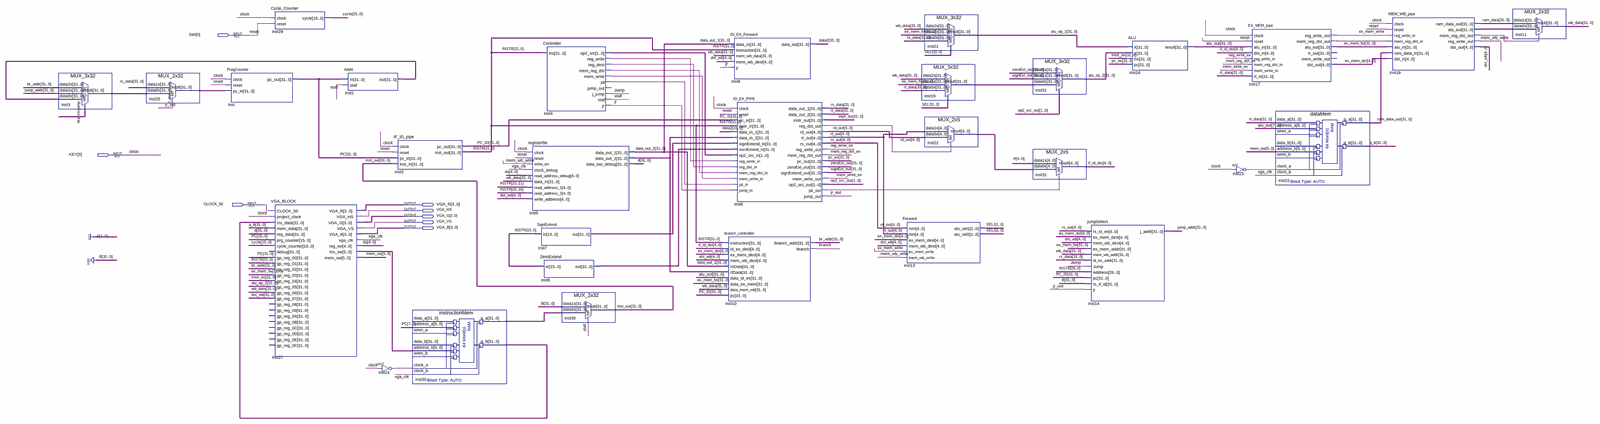
[diagram p0: schematic sheet, whole]
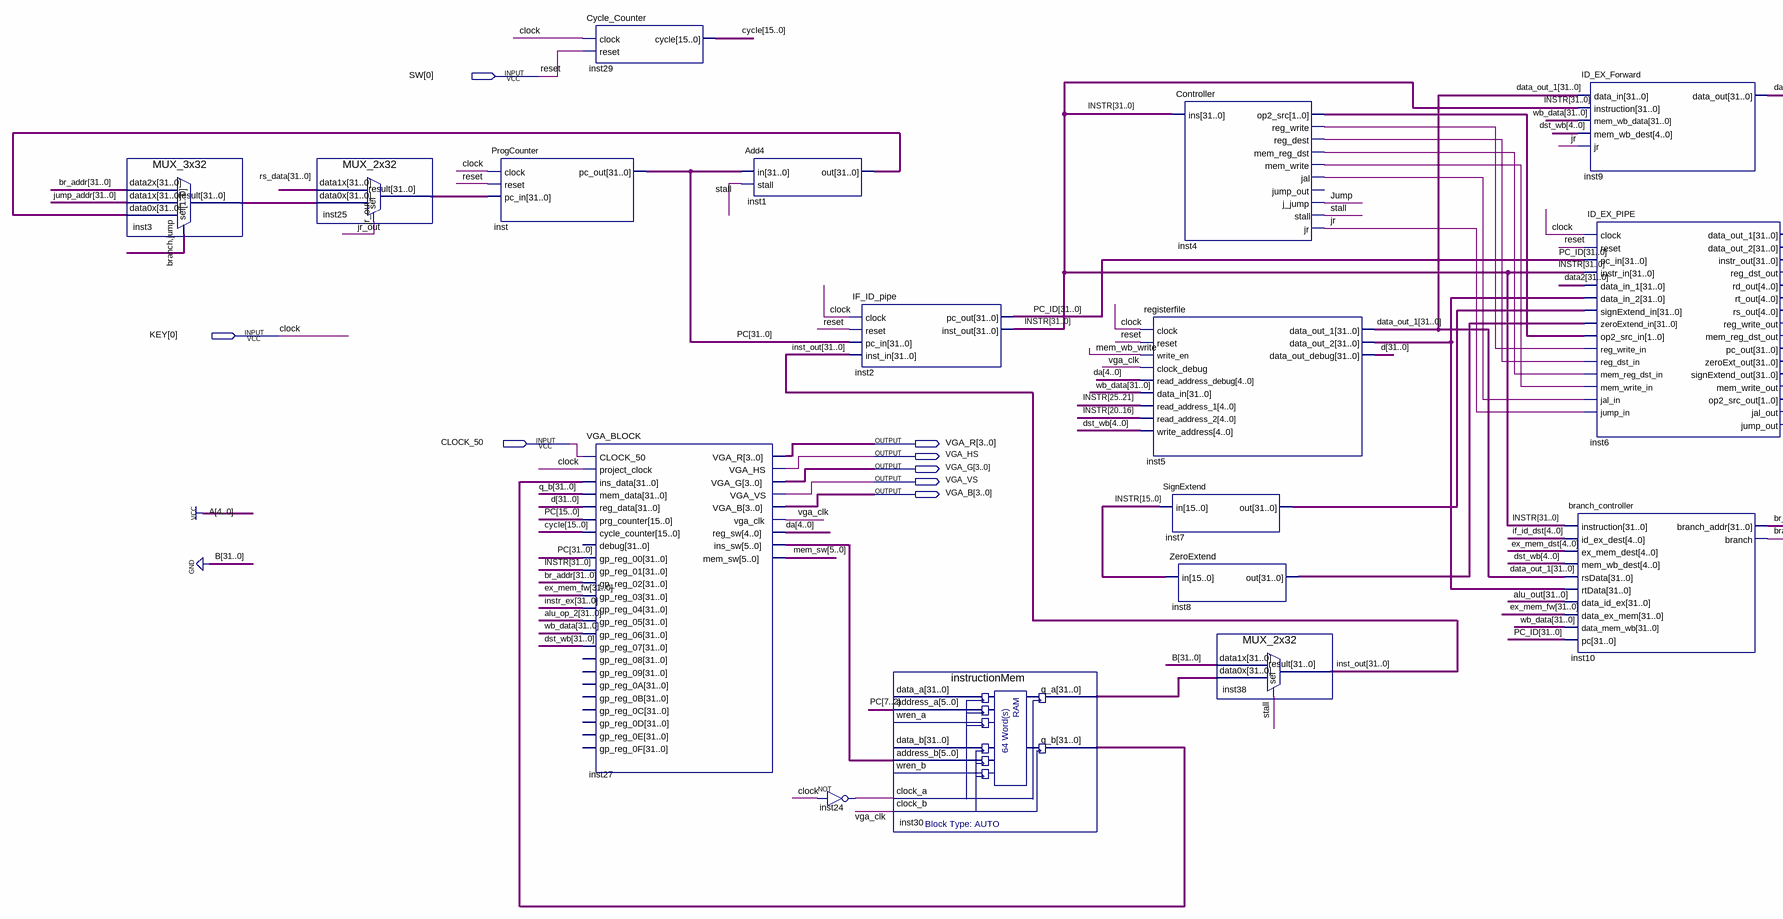
[diagram p1: schematic sheet, left part]
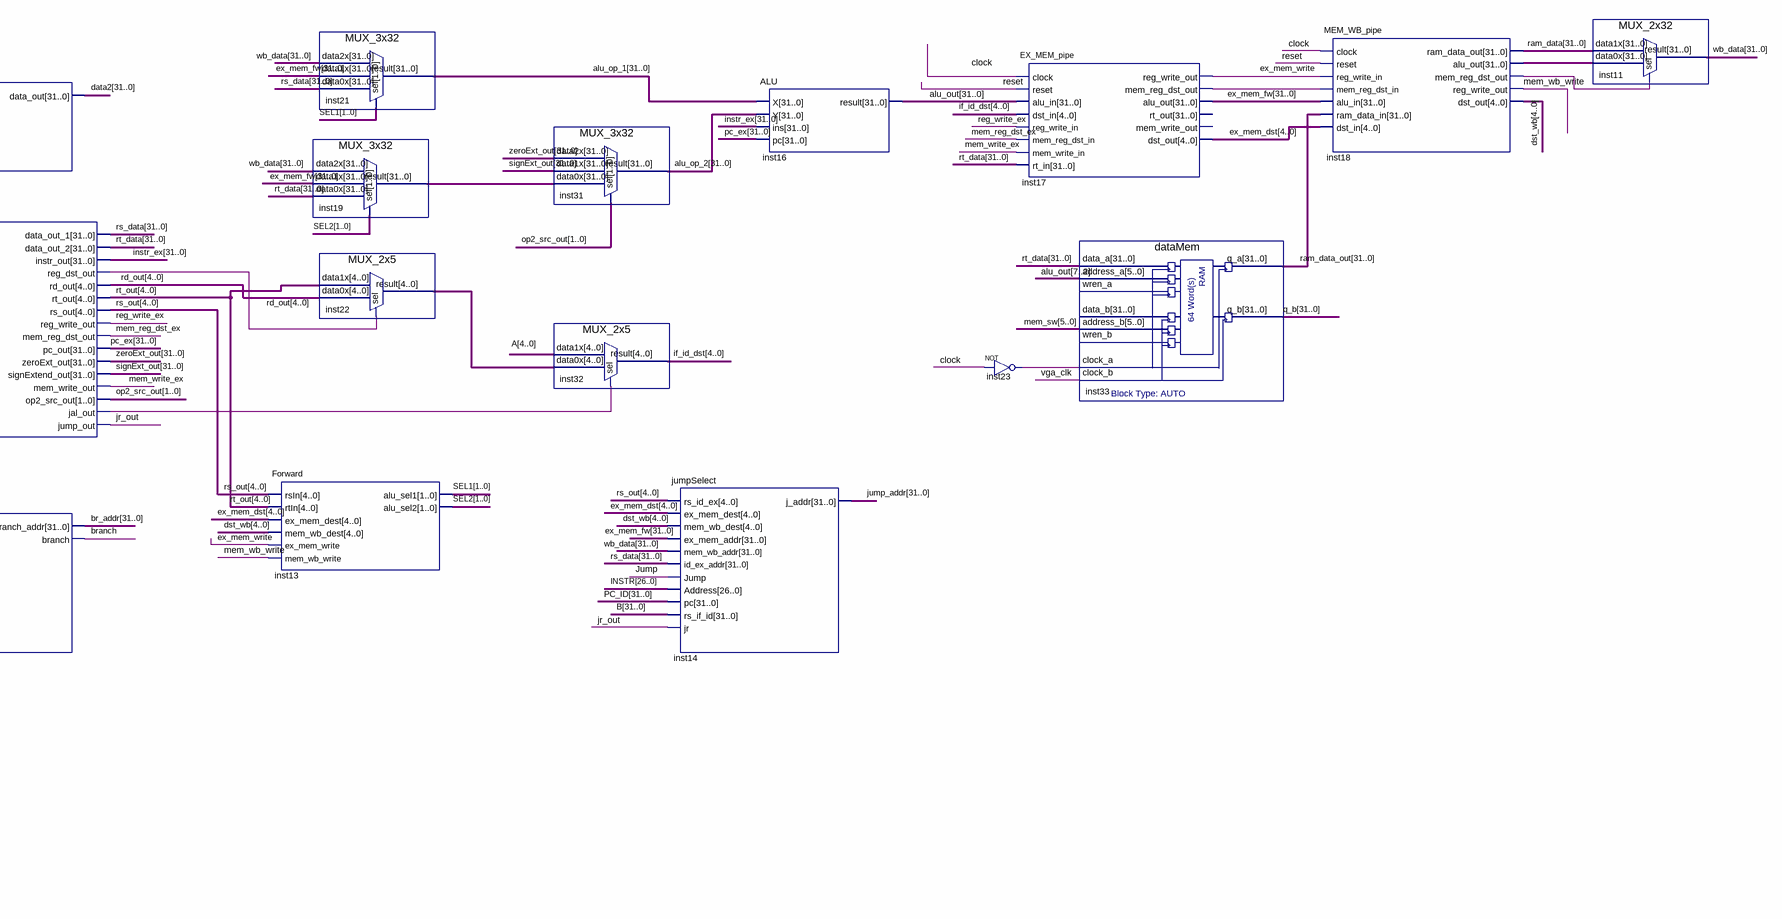
[diagram p2: schematic sheet, right part]
// Quartus schematic MILESTONE4.bdf as structural Verilog: 30 symbols, 8 pins
module MILESTONE4 (
  input  [0:0] SW,
  input  [0:0] KEY,
  input  CLOCK_50,
  output [3:0] VGA_R,
  output VGA_HS,
  output [3:0] VGA_G,
  output VGA_VS,
  output [3:0] VGA_B
);

  wire branch, ex_mem_write, inst4_jal, inst4_mem_reg_dst, inst4_mem_write, inst4_reg_dest, inst4_reg_write,
       inst6_jal_out, inst6_reg_dst_out, inst17_mem_reg_dst_out, inst18_mem_reg_dst_out, inst23_out,
       inst24_out, jr, jr_out, jump, mem_reg_dst_ex, mem_wb_write, mem_write_ex, reg_write_ex, stall, vga_clk;
  wire [1:0] inst4_op2_src, op2_src_out, SEL1, SEL2;
  wire [4:0] da, ex_mem_dst, if_id_dst, inst22_result, rd_out, rs_out, rt_out;
  wire [5:0] inst27_ins_sw, mem_sw;
  wire [15:0] cycle;
  wire [31:0] alu_op_1, alu_op_2, alu_out, br_addr, d, data2, data_out_1, dst_wb, ex_mem_fw, inst1_out,
       inst3_result, inst5_data_out_2, inst7_out, inst8_out, inst18_alu_out, inst19_result, inst25_result,
       inst30_q_a, inst30_q_b, inst_out, INSTR, instr_ex, jump_addr, PC, pc_ex, PC_ID, q_b, ram_data,
       ram_data_out, rs_data, rt_data, signExt_out, wb_data, zeroExt_out;

  MUX_3x32 inst3 (
    .data2x(br_addr), .data1x(jump_addr), .data0x(inst1_out), .sel({branch, jump}), .result(inst3_result));
  MUX_2x32 inst25 (.data1x(rs_data), .data0x(inst3_result), .sel(jr_out), .result(inst25_result));
  ProgCounter inst (.clock(KEY[0]), .reset(SW[0]), .pc_in(inst25_result), .pc_out(PC));
  Cycle_Counter inst29 (.clock(KEY[0]), .reset(SW[0]), .cycle(cycle));
  VGA_BLOCK inst27 (
    .CLOCK_50(CLOCK_50), .project_clock(KEY[0]), .ins_data(inst30_q_b), .mem_data(q_b), .reg_data(d),
    .prg_counter(PC[15:0]), .cycle_counter(cycle), .gp_reg_00(PC), .gp_reg_01(INSTR), .gp_reg_02(br_addr),
    .gp_reg_03(ex_mem_fw), .gp_reg_04(instr_ex), .gp_reg_05(alu_op_2), .gp_reg_06(wb_data),
    .gp_reg_07(dst_wb), .VGA_R(VGA_R), .VGA_HS(VGA_HS), .VGA_G(VGA_G), .VGA_VS(VGA_VS), .VGA_B(VGA_B),
    .vga_clk(vga_clk), .reg_sw(da), .ins_sw(inst27_ins_sw), .mem_sw(mem_sw));  // open: debug, gp_reg_08, gp_reg_09, gp_reg_0A, gp_reg_0B, gp_reg_0C, gp_reg_0D, gp_reg_0E, gp_reg_0F
  Add4 inst1 (.in(PC), .stall(stall), .out(inst1_out));
  IF_ID_pipe inst2 (.clock(KEY[0]), .reset(SW[0]), .pc_in(PC), .inst_in(inst_out), .pc_out(PC_ID), .inst_out(INSTR));
  not inst24 (inst24_out, KEY[0]);
  instructionMem inst30 (
    .address_a(PC[7:2]), .address_b(inst27_ins_sw), .clock_a(inst24_out), .clock_b(vga_clk),
    .q_a(inst30_q_a), .q_b(inst30_q_b));  // open: data_a, wren_a, data_b, wren_b
  registerfile inst5 (
    .clock(KEY[0]), .reset(SW[0]), .write_en(mem_wb_write), .clock_debug(vga_clk), .read_address_debug(da),
    .data_in(wb_data), .read_address_1(INSTR[25:21]), .read_address_2(INSTR[20:16]),
    .write_address(dst_wb[4:0]), .data_out_1(data_out_1), .data_out_2(inst5_data_out_2), .data_out_debug(d));
  SignExtend inst7 (.in(INSTR[15:0]), .out(inst7_out));
  ZeroExtend inst8 (.in(INSTR[15:0]), .out(inst8_out));
  Controller inst4 (
    .ins(INSTR), .op2_src(inst4_op2_src), .reg_write(inst4_reg_write), .reg_dest(inst4_reg_dest),
    .mem_reg_dst(inst4_mem_reg_dst), .mem_write(inst4_mem_write), .jal(inst4_jal), .j_jump(jump),
    .stall(stall), .jr(jr));  // open: jump_out
  MUX_2x32 inst38 (.data1x({32{1'b0}}), .data0x(inst30_q_a), .sel(stall), .result(inst_out));
  branch_controller inst10 (
    .instruction(INSTR), .id_ex_dest(if_id_dst), .ex_mem_dest(ex_mem_dst), .mem_wb_dest(dst_wb[4:0]),
    .rsData(data_out_1), .rtData(inst5_data_out_2), .data_id_ex(alu_out), .data_ex_mem(ex_mem_fw),
    .data_mem_wb(wb_data), .pc(PC_ID), .branch_addr(br_addr), .branch(branch));
  ID_EX_Forward inst9 (
    .data_in(data_out_1), .instruction(INSTR), .mem_wb_data(wb_data), .mem_wb_dest(dst_wb[4:0]), .jr(jr),
    .data_out(data2));
  ID_EX_PIPE inst6 (
    .clock(KEY[0]), .reset(SW[0]), .pc_in(PC_ID), .instr_in(INSTR), .data_in_1(data2),
    .data_in_2(inst5_data_out_2), .signExtend_in(inst7_out), .zeroExtend_in(inst8_out),
    .op2_src_in(inst4_op2_src), .reg_write_in(inst4_reg_write), .reg_dst_in(inst4_reg_dest),
    .mem_reg_dst_in(inst4_mem_reg_dst), .mem_write_in(inst4_mem_write), .jal_in(inst4_jal), .jump_in(jr),
    .data_out_1(rs_data), .data_out_2(rt_data), .instr_out(instr_ex), .reg_dst_out(inst6_reg_dst_out),
    .rd_out(rd_out), .rt_out(rt_out), .rs_out(rs_out), .reg_write_out(reg_write_ex),
    .mem_reg_dst_out(mem_reg_dst_ex), .pc_out(pc_ex), .zeroExt_out(zeroExt_out),
    .signExtend_out(signExt_out), .mem_write_out(mem_write_ex), .op2_src_out(op2_src_out),
    .jal_out(inst6_jal_out), .jump_out(jr_out));
  Forward inst13 (
    .rsIn(rs_out), .rtIn(rt_out), .ex_mem_dest(ex_mem_dst), .mem_wb_dest(dst_wb[4:0]),
    .ex_mem_write(ex_mem_write), .mem_wb_write(mem_wb_write), .alu_sel1(SEL1), .alu_sel2(SEL2));
  MUX_3x32 inst21 (.data2x(wb_data), .data1x(ex_mem_fw), .data0x(rs_data), .sel(SEL1), .result(alu_op_1));
  MUX_3x32 inst19 (.data2x(wb_data), .data1x(ex_mem_fw), .data0x(rt_data), .sel(SEL2), .result(inst19_result));
  MUX_2x5 inst22 (.data1x(rt_out), .data0x(rd_out), .sel(inst6_reg_dst_out), .result(inst22_result));
  MUX_3x32 inst31 (
    .data2x(zeroExt_out), .data1x(signExt_out), .data0x(inst19_result), .sel(op2_src_out), .result(alu_op_2));
  MUX_2x5 inst32 (.data1x({5{1'b1}}), .data0x(inst22_result), .sel(inst6_jal_out), .result(if_id_dst));
  jumpSelect inst14 (
    .rs_id_ex(rs_out), .ex_mem_dest(ex_mem_dst), .mem_wb_dest(dst_wb[4:0]), .ex_mem_addr(ex_mem_fw),
    .mem_wb_addr(wb_data), .id_ex_addr(rs_data), .Jump(jump), .Address(INSTR[26:0]), .pc(PC_ID),
    .rs_if_id({32{1'b0}}), .jr(jr_out), .j_addr(jump_addr));
  ALU inst16 (.X(alu_op_1), .Y(alu_op_2), .ins(instr_ex), .pc(pc_ex), .result(alu_out));
  not inst23 (inst23_out, KEY[0]);
  EX_MEM_pipe inst17 (
    .clock(KEY[0]), .reset(SW[0]), .alu_in(alu_out), .dst_in(if_id_dst), .reg_write_in(reg_write_ex),
    .mem_reg_dst_in(mem_reg_dst_ex), .mem_write_in(mem_write_ex), .rt_in(rt_data),
    .reg_write_out(ex_mem_write), .mem_reg_dst_out(inst17_mem_reg_dst_out), .alu_out(ex_mem_fw),
    .dst_out(ex_mem_dst));  // open: rt_out, mem_write_out
  dataMem inst33 (
    .data_a(rt_data), .address_a(alu_out[7:2]), .address_b(mem_sw), .clock_a(inst23_out), .clock_b(vga_clk),
    .q_a(ram_data_out), .q_b(q_b));  // open: wren_a, data_b, wren_b
  MEM_WB_pipe inst18 (
    .clock(KEY[0]), .reset(SW[0]), .reg_write_in(ex_mem_write), .mem_reg_dst_in(inst17_mem_reg_dst_out),
    .alu_in(ex_mem_fw), .ram_data_in(ram_data_out), .dst_in(ex_mem_dst), .ram_data_out(ram_data),
    .alu_out(inst18_alu_out), .mem_reg_dst_out(inst18_mem_reg_dst_out), .reg_write_out(mem_wb_write),
    .dst_out(dst_wb[4:0]));
  MUX_2x32 inst11 (.data1x(ram_data), .data0x(inst18_alu_out), .sel(inst18_mem_reg_dst_out), .result(wb_data));

  // Other names for the same wires on the sheet: clock = KEY[0]; reset = SW[0]
endmodule
